# Altium schematic sheet 7-serial-interfaces.SchDoc
size B
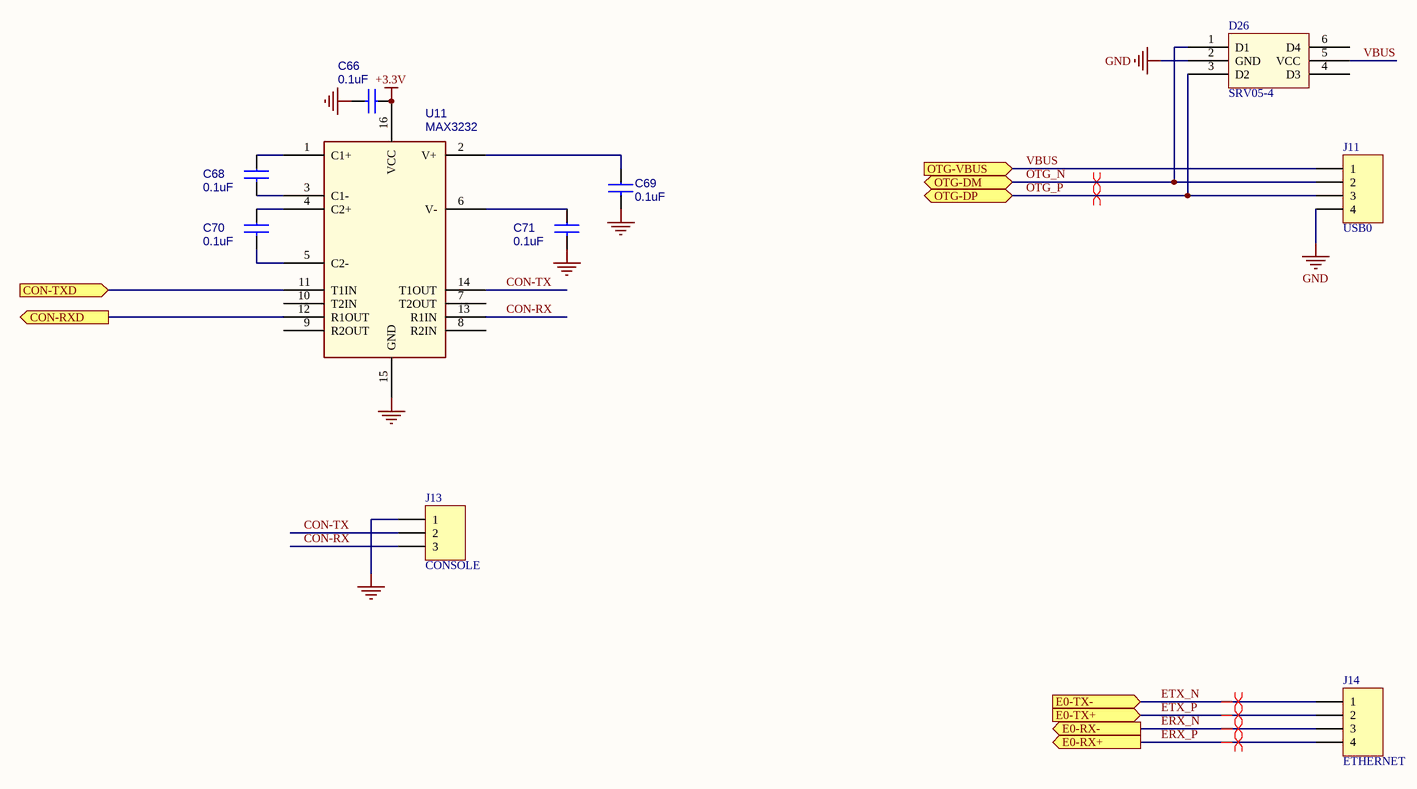
[diagram p0: 7-serial-interfaces.SchDoc]

## Parts
C66  0.1uF  [0603]
C68  0.1uF  [0603]
C69  0.1uF  [0603]
C70  0.1uF  [0603]
C71  0.1uF  [0603]
D26  SRV05-4  [SOT23-6]
J11  USB0  [CON-4PIN]
J13  CONSOLE  [CONN-3P]
J14  ETHERNET  [CON-4PIN]
U11  MAX3232  [SO-16]

## Ports
CON-RXD (out), CON-TXD (in), E0-RX+ (out), E0-RX- (out), E0-TX+ (in), E0-TX- (in), OTG-DM (bidir), OTG-DP (bidir), OTG-VBUS (in)

## Nets
+3.3V: C66.1 U11.16(VCC)
GND: C66.2 C69.2 C71.2 D26.2(GND) J11.4 J13.1 U11.15(GND)
CON-RX: J13.3 U11.13(R1IN)
CON-RXD: U11.12(R1OUT) ; port CON-RXD
CON-TX: J13.2 U11.14(T1OUT)
CON-TXD: U11.11(T1IN) ; port CON-TXD
ERX_N: J14.3 ; port E0-RX-
ERX_P: J14.4 ; port E0-RX+
ETX_N: J14.1 ; port E0-TX-
ETX_P: J14.2 ; port E0-TX+
OTG_N: D26.1(D1) J11.2 ; port OTG-DM
OTG_P: D26.3(D2) J11.3 ; port OTG-DP
VBUS: D26.5(VCC) J11.1 ; port OTG-VBUS
NetC68_1: C68.1 U11.1(C1+)
NetC68_2: C68.2 U11.3(C1-)
NetC69_1: C69.1 U11.2(V+)
NetC70_1: C70.1 U11.4(C2+)
NetC70_2: C70.2 U11.5(C2-)
NetC71_1: C71.1 U11.6(V-)

Not connected (* = marked no-connect by the designer): D26 4(D3) 6(D4); U11 7(T2OUT) 8(R2IN) 9(R2OUT) 10(T2IN)

## Layout directives
differential pair: ERX_N, ERX_P, ETX_N, ETX_P, OTG_N, OTG_P

## Library data of the parts
C66 C68-C71 = CAP
J11 J14 = Header 4: Header, 4-Pin; LatestRevisionDate: 17-Jul-2002; LatestRevisionNote: Re-released for DXP Platform.; Publisher: Altium Limited
J13 = Header 3: Header, 3-Pin; LatestRevisionDate: 17-Jul-2002; LatestRevisionNote: Re-released for DXP Platform.; Publisher: Altium Limited